# EAGLE design can4wrt (EAGLE 4.13)
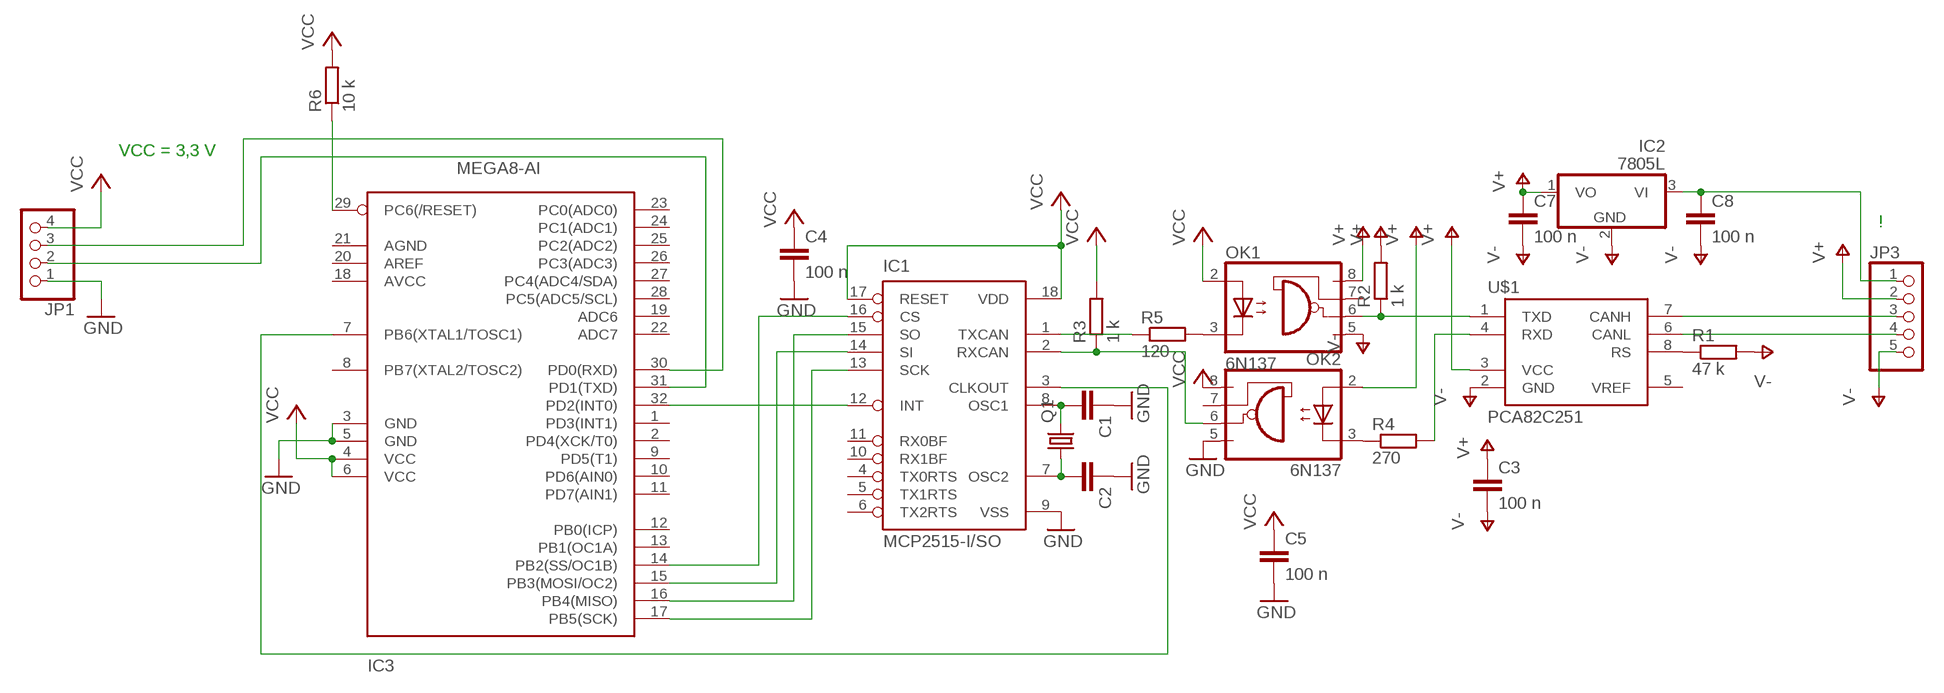
[diagram p0: schematic, sheet 1]

## Parts
C1  C-EU025-025X050  [C025-025X050]
C2  C-EU025-025X050  [C025-025X050]
C3  100 n  C-EUC1206  [C1206]
C4  100 n  C-EUC1206  [C1206]
C5  100 n  C-EUC1206  [C1206]
C7  100 n  C-EUC1206  [C1206]
C8  100 n  C-EUC1206  [C1206]
IC1  MCP2515-I/SO  [SO18L]
IC2  7805L  [TO92]
IC3  MEGA8-AI  [TQFP32-08]
JP1  PINHD-1X4  [1X04]
JP3  PINHD-1X5  [1X05]
OK1  6N137  [DIL08]
OK2  6N137  [DIL08]
Q1  CRYTALHC49S  [HC49/S]
R1  47 k  R-EU_0207/10  [0207/10]
R2  1 k  R-EU_0207/10  [0207/10]
R3  1 k  R-EU_0207/10  [0207/10]
R4  270  R-EU_0207/10  [0207/10]
R5  120  R-EU_0207/10  [0207/10]
R6  10 k  R-EU_0207/10  [0207/10]
U$1  PCA82C251  [SO08]

## Nets
GND: C1.1 C2.1 C4.2 C5.2 IC1.9(VSS) IC3.3(GND) IC3.5(GND) JP1.1 OK2.5(GND)
N$1: IC1.15(SO) IC3.16(PB4(MISO))
N$2: IC1.13(SCK) IC3.17(PB5(SCK))
N$3: IC1.14(SI) IC3.15(PB3(MOSI/OC2))
N$4: IC1.16(CS) IC3.14(PB2(SS/OC1B))
N$5: IC1.12(INT) IC3.32(PD2(INT0))
N$6: OK1.6(VO) R2.1 U$1.1(TXD)
N$7: IC1.3(CLKOUT) IC3.7(PB6(XTAL1/TOSC1))
N$8: C1.2 IC1.8(OSC1) Q1.2
N$9: C2.2 IC1.7(OSC2) Q1.1
N$10: OK2.3(C) R4.1
N$11: R4.2 U$1.4(RXD)
N$12: R1.1 U$1.8(RS)
N$13: OK1.3(C) R5.2
N$14: IC1.2(RXCAN) OK2.6(VO) R3.1
N$15: IC1.1(TXCAN) R5.1
N$17: IC3.31(PD1(TXD)) JP1.2
N$18: IC3.30(PD0(RXD)) JP1.3
N$20: IC3.29(PC6(/RESET)) R6.1
N$22: JP3.4 U$1.6(CANL)
N$23: JP3.3 U$1.7(CANH)
N$24: C8.1 IC2.3(VI) JP3.1
V+: C3.1 C7.1 IC2.1(VO) JP3.2 OK1.8(VCC) OK2.2(A) R2.2 U$1.3(VCC)
V-: C3.2 C7.2 C8.2 IC2.2(GND) JP3.5 OK1.5(GND) R1.2 U$1.2(GND)
VCC: C4.1 C5.1 IC1.17(RESET) IC1.18(VDD) IC3.4(VCC) IC3.6(VCC) JP1.4 OK1.2(A) OK2.8(VCC) R3.2 R6.2
Unconnected: IC1.4(TX0RTS) IC1.5(TX1RTS) IC1.6(TX2RTS) IC1.10(RX1BF) IC1.11(RX0BF) IC3.1(PD3(INT1)) IC3.2(PD4(XCK/T0)) IC3.8(PB7(XTAL2/TOSC2)) IC3.9(PD5(T1)) IC3.10(PD6(AIN0)) IC3.11(PD7(AIN1)) IC3.12(PB0(ICP)) IC3.13(PB1(OC1A)) IC3.18(AVCC) IC3.19(ADC6) IC3.20(AREF) IC3.21(AGND) IC3.22(ADC7) IC3.23(PC0(ADC0)) IC3.24(PC1(ADC1)) IC3.25(PC2(ADC2)) IC3.26(PC3(ADC3)) IC3.27(PC4(ADC4/SDA)) IC3.28(PC5(ADC5/SCL)) OK1.7(VE) OK2.7(VE) U$1.5(VREF)

## Notes on the sheet
- VCC = 3,3 V
- !

## Library data of the parts
C1-C5 C7 C8 = rcl:C-EU: CAPACITOR, European symbol
IC1 = mcp2515:MCP2515
IC2 = linear:78*: Positive VOLTAGE REGULATOR
IC3 = atmel:MEGA8: MICROCONTROLLER 8 Kbytes FLASH 1 kbytes SRAM 512 bytes EEPROM USART 6-channel 10 bit ADC 2-channel 8 bit ADC
JP1 = pinhead:PINHD-1X4: PIN HEADER
JP3 = pinhead:PINHD-1X5: PIN HEADER
OK1 OK2 = optocoupler:6N137: MOTOROLA OPTO COUPLER
Q1 = crystal:CRYTAL: CRYSTAL
R1-R6 = rcl:R-EU_: RESISTOR, European symbol
U$1 = PCA82C25x:PCA82C251

## Board
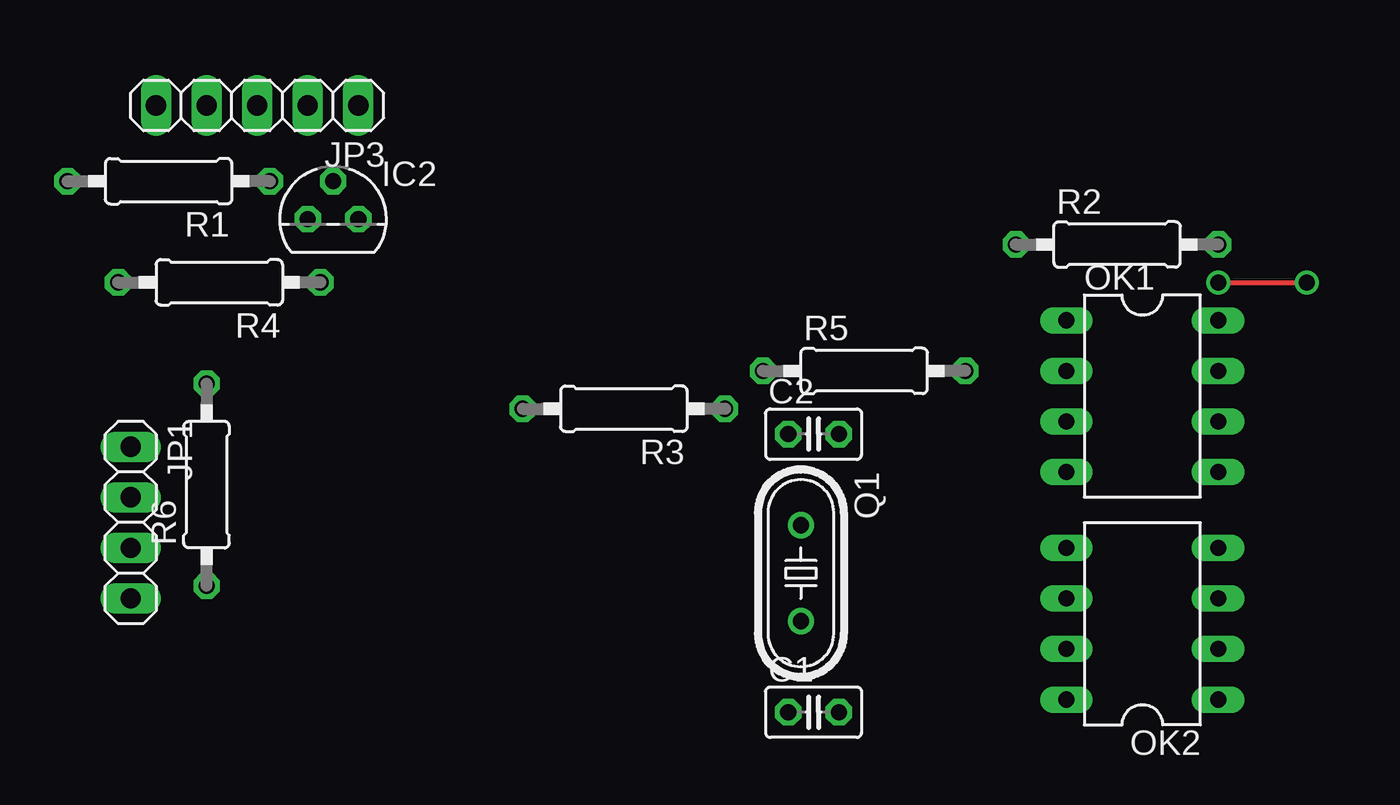
[diagram p1: board, top side]
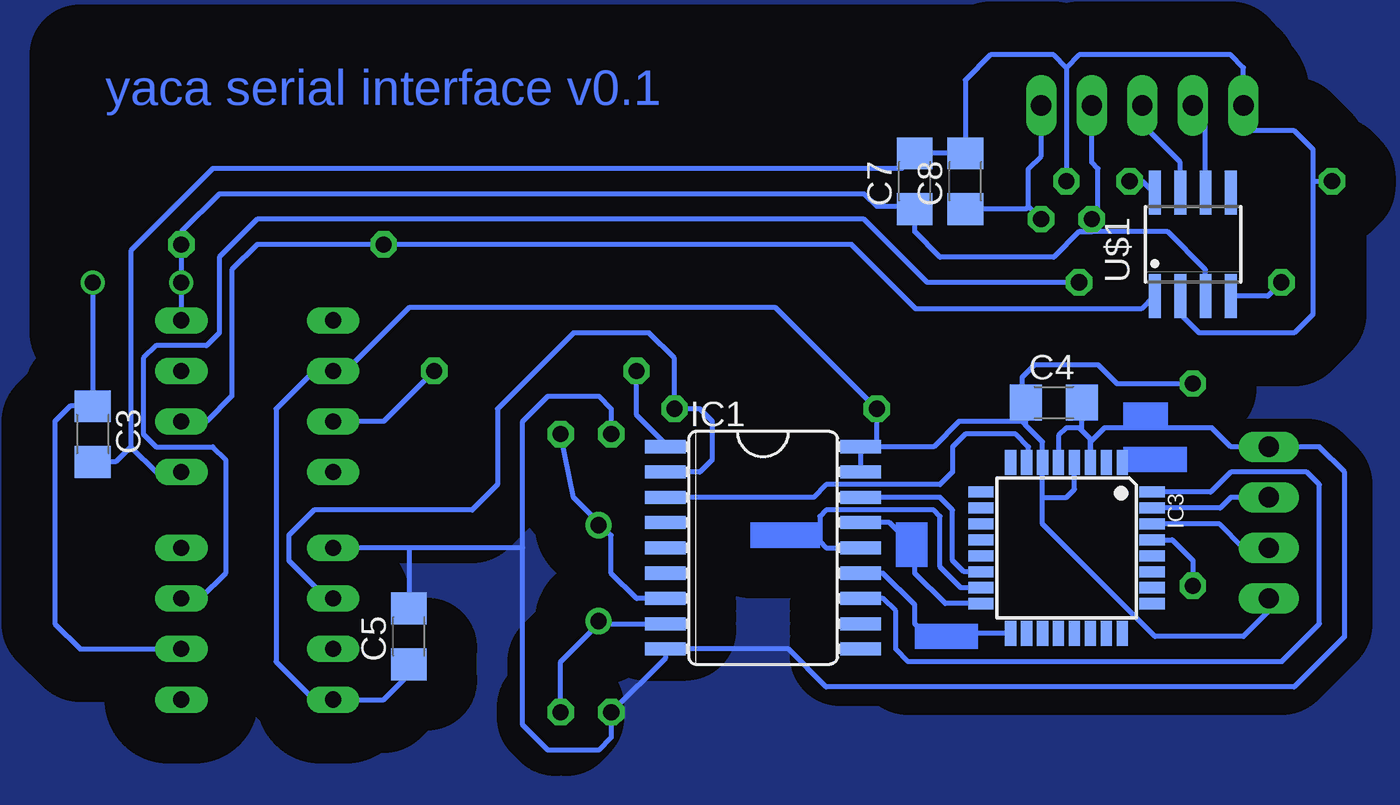
[diagram p2: board, bottom side, seen from below]

No outline drawn. Coordinates in mm, seen from the top.
Copper layers (1*16): Top 0.035mm / dielectric 1.5mm / Bottom 0.035mm
Design rules "default": minimum track width 10mil, minimum drill 24mil, track to track 8mil, track to pad 8mil, pad to pad 8mil, via to via 8mil, smd to smd 8mil, copper to edge 40mil, drill to drill 8mil, minimum pad ring 10mil, minimum via ring 8mil, stop-mask expansion 4mil, vias tented up to drill 0mil, thermal gap 10mil
bRestrict: area 23.5,25.4 to 68.6,39.4

### Footprints (pad centres in the part's own frame; a part is rotated, then mirrored left to right if it is on the bottom)
C025-025X050 = drill 0.813 octagon: 1 -1.27,0; 2 1.27,0
C1206 = smd 1.6 x 1.8: 1 -1.4,0; 2 1.4,0
SO18L = smd 0.66 x 2.032: 1 -5.08,-4.902; 2 -3.81,-4.902; 3 -2.54,-4.902; 4 -1.27,-4.902; 5 0,-4.902; 6 1.27,-4.902; 7 2.54,-4.902; 8 3.81,-4.902; 9 5.08,-4.902; 10 5.08,4.902; 11 3.81,4.902; 12 2.54,4.902; 13 1.27,4.902; 14 0,4.902; 15 -1.27,4.902; 16 -2.54,4.902; 17 -3.81,4.902; 18 -5.08,4.902
TO92 = drill 0.813 octagon: 1 -1.27,0; 2 0,1.905; 3 1.27,0
TQFP32-08 = smd 1.27 x 0.559: 1 -4.293,2.8; 2 -4.293,2; 3 -4.293,1.2; 4 -4.293,0.4; 5 -4.293,-0.4; 6 -4.293,-1.2; 7 -4.293,-2; 8 -4.293,-2.8; 17 4.293,-2.8; 18 4.293,-2; 19 4.293,-1.2; 20 4.293,-0.4; 21 4.293,0.4; 22 4.293,1.2; 23 4.293,2; 24 4.293,2.8 | smd 0.559 x 1.27: 9 -2.8,-4.293; 10 -2,-4.293; 11 -1.2,-4.293; 12 -0.4,-4.293; 13 0.4,-4.293; 14 1.2,-4.293; 15 2,-4.293; 16 2.8,-4.293; 25 2.8,4.293; 26 2,4.293; 27 1.2,4.293; 28 0.4,4.293; 29 -0.4,4.293; 30 -1.2,4.293; 31 -2,4.293; 32 -2.8,4.293
1X04 = drill 1.016 long: 1 -3.81,0; 2 -1.27,0; 3 1.27,0; 4 3.81,0
1X05 = drill 1.016 long: 1 -5.08,0; 2 -2.54,0; 3 0,0; 4 2.54,0; 5 5.08,0
DIL08 = drill 0.813 long: 1 -3.81,-3.81; 2 -1.27,-3.81; 3 1.27,-3.81; 4 3.81,-3.81; 5 3.81,3.81; 6 1.27,3.81; 7 -1.27,3.81; 8 -3.81,3.81
HC49/S = drill 0.813 round: 1 -2.413,0; 2 2.413,0
0207/10 = drill 0.813 octagon: 1 -5.08,0; 2 5.08,0
SO08 = smd 0.6 x 2.2: 1 -1.905,-2.6; 2 -0.635,-2.6; 3 0.635,-2.6; 4 1.905,-2.6; 5 1.905,2.6; 6 0.635,2.6; 7 -0.635,2.6; 8 -1.905,2.6

### Placement (x,y rotation side)
C1  43.18,6.35 0 top
C2  43.18,20.32 0 top
C3  67.94,20.32 270 bottom
C4  19.68,21.91 0 bottom
C5  52.07,10.16 90 bottom
C7  26.67,33.02 90 bottom
C8  24.13,33.02 90 bottom
IC1  34.29,14.61 270 bottom
IC2  19.05,31.11 0 top
IC3  19.05,14.61 270 bottom
JP1  8.89,15.88 270 top
JP3  15.24,36.83 180 top
OK1  59.69,22.23 270 top
OK2  59.69,10.79 90 top
Q1  42.55,13.34 270 top
R1  10.79,33.02 180 top
R2  58.42,29.84 0 top
R3  33.66,21.59 180 top
R4  13.34,27.94 180 top
R5  45.72,23.5 0 top
R6  12.7,17.78 90 top
U$1  12.7,29.84 0 bottom

### Tracks (layer width: path | path; a pad name or v marks a point on that pad's centre or on a via)
GND
  Bottom 0.254: 18.1,20.32 17.85,20.07 IC3.3 17.85,19.93 17.14,20.64 11.75,20.64 10.79,19.68 JP1.1 6.35,19.68 5.08,18.41 5.08,10.16 7.62,7.62 31.11,7.62 33.02,9.53 IC1.9 39.19,9.07 C1.1 41.91,5.08 42.55,4.45 45.09,4.45 46.35,5.71 46.35,14.61 | 18.1,20.32 18.41,20.64 19.05,20.64 19.45,20.24 IC3.5 | C2.1 41.91,21.59 42.55,22.23 45.09,22.23 46.35,20.95 46.35,14.61 | C4.2 18.29,20.51 18.1,20.32 | 46.35,14.61 52.07,14.61 | 52.07,14.61 OK2.5 | 52.07,14.61 C5.2
  pour Bottom (isolate 2.54, no thermals): -8.26,51.44 85.72,51.44 85.72,-7.62 -8.26,-7.62
N$1
  Bottom 0.254: IC3.16 25.14,11.8 26.67,13.34 26.67,14.61 27.94,15.88 IC1.15
N$2
  Bottom 0.254: IC3.17 26.19,10.31 26.67,10.79 26.67,11.75 28.26,13.34 IC1.13
N$3
  Bottom 0.254: IC3.15 24.35,12.61 25.4,13.65 25.4,16.19 25.72,16.51 31.11,16.51 31.43,16.19 31.43,14.92 31.11,14.61 IC1.14 29.21,14.61
N$4
  Bottom 0.254: IC1.16 25.4,17.14 24.77,16.51 24.77,13.97 24.2,13.4 IC3.14
N$5
  Bottom 0.254: IC3.32 11.8,17.41 10.79,18.41 6.99,18.41 6.35,17.78 6.35,10.79 8.26,8.89 26.99,8.89 27.62,9.53 27.62,11.43 28.26,12.06 IC1.12
N$6
  Bottom 0.254: OK1.6 62.23,20.95 60.96,22.23 60.96,28.57 59.69,29.84 R2.1 29.84,29.84 26.61,26.61 15.3,26.61 14.66,27.25 U$1.1
N$7
  Bottom 0.254: IC1.3 31.75,17.14 31.11,17.78 25.4,17.78 24.77,18.41 24.77,19.68 24.13,20.32 21.59,20.32 20.95,19.68 20.95,18.73 21.05,18.83 IC3.7
N$8
  Bottom 0.254: 42.55,10.79 IC1.8 | 42.55,10.79 Q1.2 | C1.2 44.45,8.89 42.55,10.79
N$9
  Bottom 0.254: IC1.7 40.64,12.06 41.91,13.34 41.91,15.24 42.55,15.88 | 42.55,15.88 Q1.1 | C2.2 43.81,17.14 42.55,15.88
N$10
  Bottom 0.254: OK2.3 62.55,12.06 61.28,13.34 61.28,19.05 61.91,19.68 64.77,19.68 65.41,20.32 65.41,24.13 64.77,24.77 62.23,24.77 61.59,25.4 61.59,29.21 59.69,31.11 29.21,31.11 26.04,27.94 R4.1
N$11
  Bottom 0.254: U$1.4 8.95,27.25 R4.2
N$12
  Bottom 0.254: U$1.8 14.66,32.45 15.24,33.02 R1.1
N$13
  Bottom 0.254: R5.2 53.34,20.95 OK1.3
N$14
  Bottom 0.254: IC1.2 37.47,18.41 36.83,19.05 36.83,20.95 37.47,21.59 R3.1 38.73,24.13 40.01,25.4 43.81,25.4 47.62,21.59 47.62,17.78 48.9,16.51 56.83,16.51 58.1,15.24 58.1,13.97 56.2,12.06 OK2.6
N$15
  Bottom 0.254: IC1.1 39.19,19.82 40.64,21.27 R5.1
N$17
  Bottom 0.254: IC3.31 11.34,16.61 10.79,17.14 JP1.2
N$18
  Bottom 0.254: IC3.30 11.36,15.8 10.16,14.61 JP1.3
N$20
  Bottom 0.254: IC3.29 13.73,15.01 12.7,13.97 R6.1
N$22
  Bottom 0.254: U$1.6 12.06,36.2 JP3.4
N$23
  Bottom 0.254: U$1.7 13.34,33.97 15.24,35.88 JP3.3
N$24
  Bottom 0.254: JP3.1 20.32,34.29 20.95,33.66 20.95,31.75 | IC2.3 20.95,31.75 | C8.1 21.09,31.62 20.95,31.75
V+  (via drill 0.8)
  Top 0.254: v63.5,27.94 v67.94,27.94
  Bottom 0.254: JP3.2 17.78,33.97 17.46,33.66 17.46,31.43 IC2.1 17.78,30.48 18.41,30.48 | 26.67,30.48 C7.1 | 26.67,30.48 25.4,29.21 19.68,29.21 18.41,30.48 | 18.41,30.48 13.97,30.48 12.06,28.57 U$1.3 | 26.67,30.48 26.67,31.75 28.57,31.75 29.21,32.38 61.59,32.38 63.5,30.48 R2.2 v63.5,27.94 OK1.8 | v67.94,27.94 C3.1 69.08,21.72 69.85,20.95 69.85,10.79 68.58,9.53 OK2.2
V-
  Bottom 0.254: 19.05,38.73 IC2.2 | 19.05,38.73 18.41,39.37 10.79,39.37 10.16,38.73 JP3.5 10.16,35.56 7.62,35.56 6.67,34.61 6.67,33.02 | 19.05,38.73 19.68,39.37 22.86,39.37 24.13,38.1 C8.2 24.13,34.29 24.26,34.42 C7.2 26.67,34.29 27.3,33.66 61.91,33.66 66.04,29.53 66.04,19.68 | OK1.5 64.77,18.41 66.04,19.68 | U$1.2 13.34,26.35 12.38,25.4 7.62,25.4 6.67,26.35 6.67,33.02 | 6.67,33.02 R1.2 | C3.2 66.81,18.92 66.04,19.68
VCC
  Bottom 0.254: JP1.4 8.89,11.43 10.16,10.16 14.61,10.16 20.25,15.8 20.25,17.14 | 20.25,17.14 IC3.6 20.25,19.93 20.95,20.64 | IC3.4 18.65,17.55 19.05,17.14 20.25,17.14 | 20.95,20.64 21.27,20.95 24.45,20.95 25.72,19.68 28.57,19.68 | 29.53,19.68 IC1.18 29.21,19.68 | 28.57,19.68 29.21,19.68 | IC1.17 29.39,19.51 29.21,19.68 | 20.95,20.64 21.09,20.77 C4.1 20.95,21.91 21.27,22.23 21.27,23.18 20.64,23.81 17.46,23.81 16.51,22.86 R6.2 | 28.57,19.68 R3.2 33.66,26.67 52.07,26.67 55.24,23.5 OK1.2 56.83,23.5 58.74,21.59 58.74,8.89 56.83,6.99 OK2.8 53.34,6.99 52.07,8.26 C5.1
(copper drawn outside any net)
  shapes: Bottom area x5

### Text on the board
Bottom: yaca serial interface v0.1